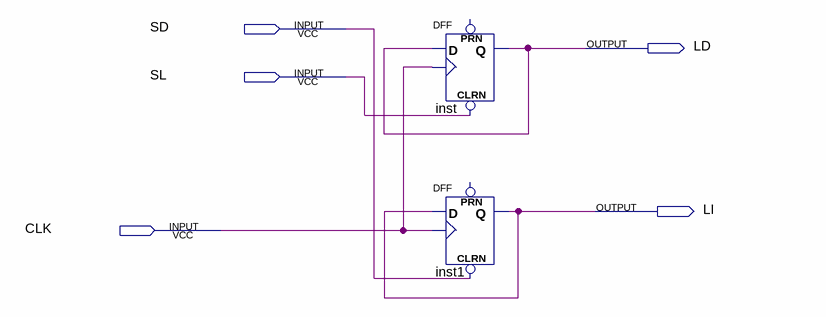
[diagram p0: schematic sheet]
// Quartus schematic Luces_Intermitentes.bdf as structural Verilog: 2 symbols, 5 pins
module Luces_Intermitentes (
  input  SD,
  input  SL,
  input  CLK,
  output LD,
  output LI
);

  DFF inst (.CLRN(SL), .CLK(CLK), .D(LD), .Q(LD));  // open: PRN
  DFF inst1 (.CLRN(SD), .CLK(CLK), .D(LI), .Q(LI));  // open: PRN
endmodule
